# EasyEDA schematic 1-Schematic_V1.0-A4988.json
TITLE: 步进电机驱动板; REV: 1.0; Date: 2021-02-19; Sheet: 1/1; Drawn By: Poaoz; Company: Your Company
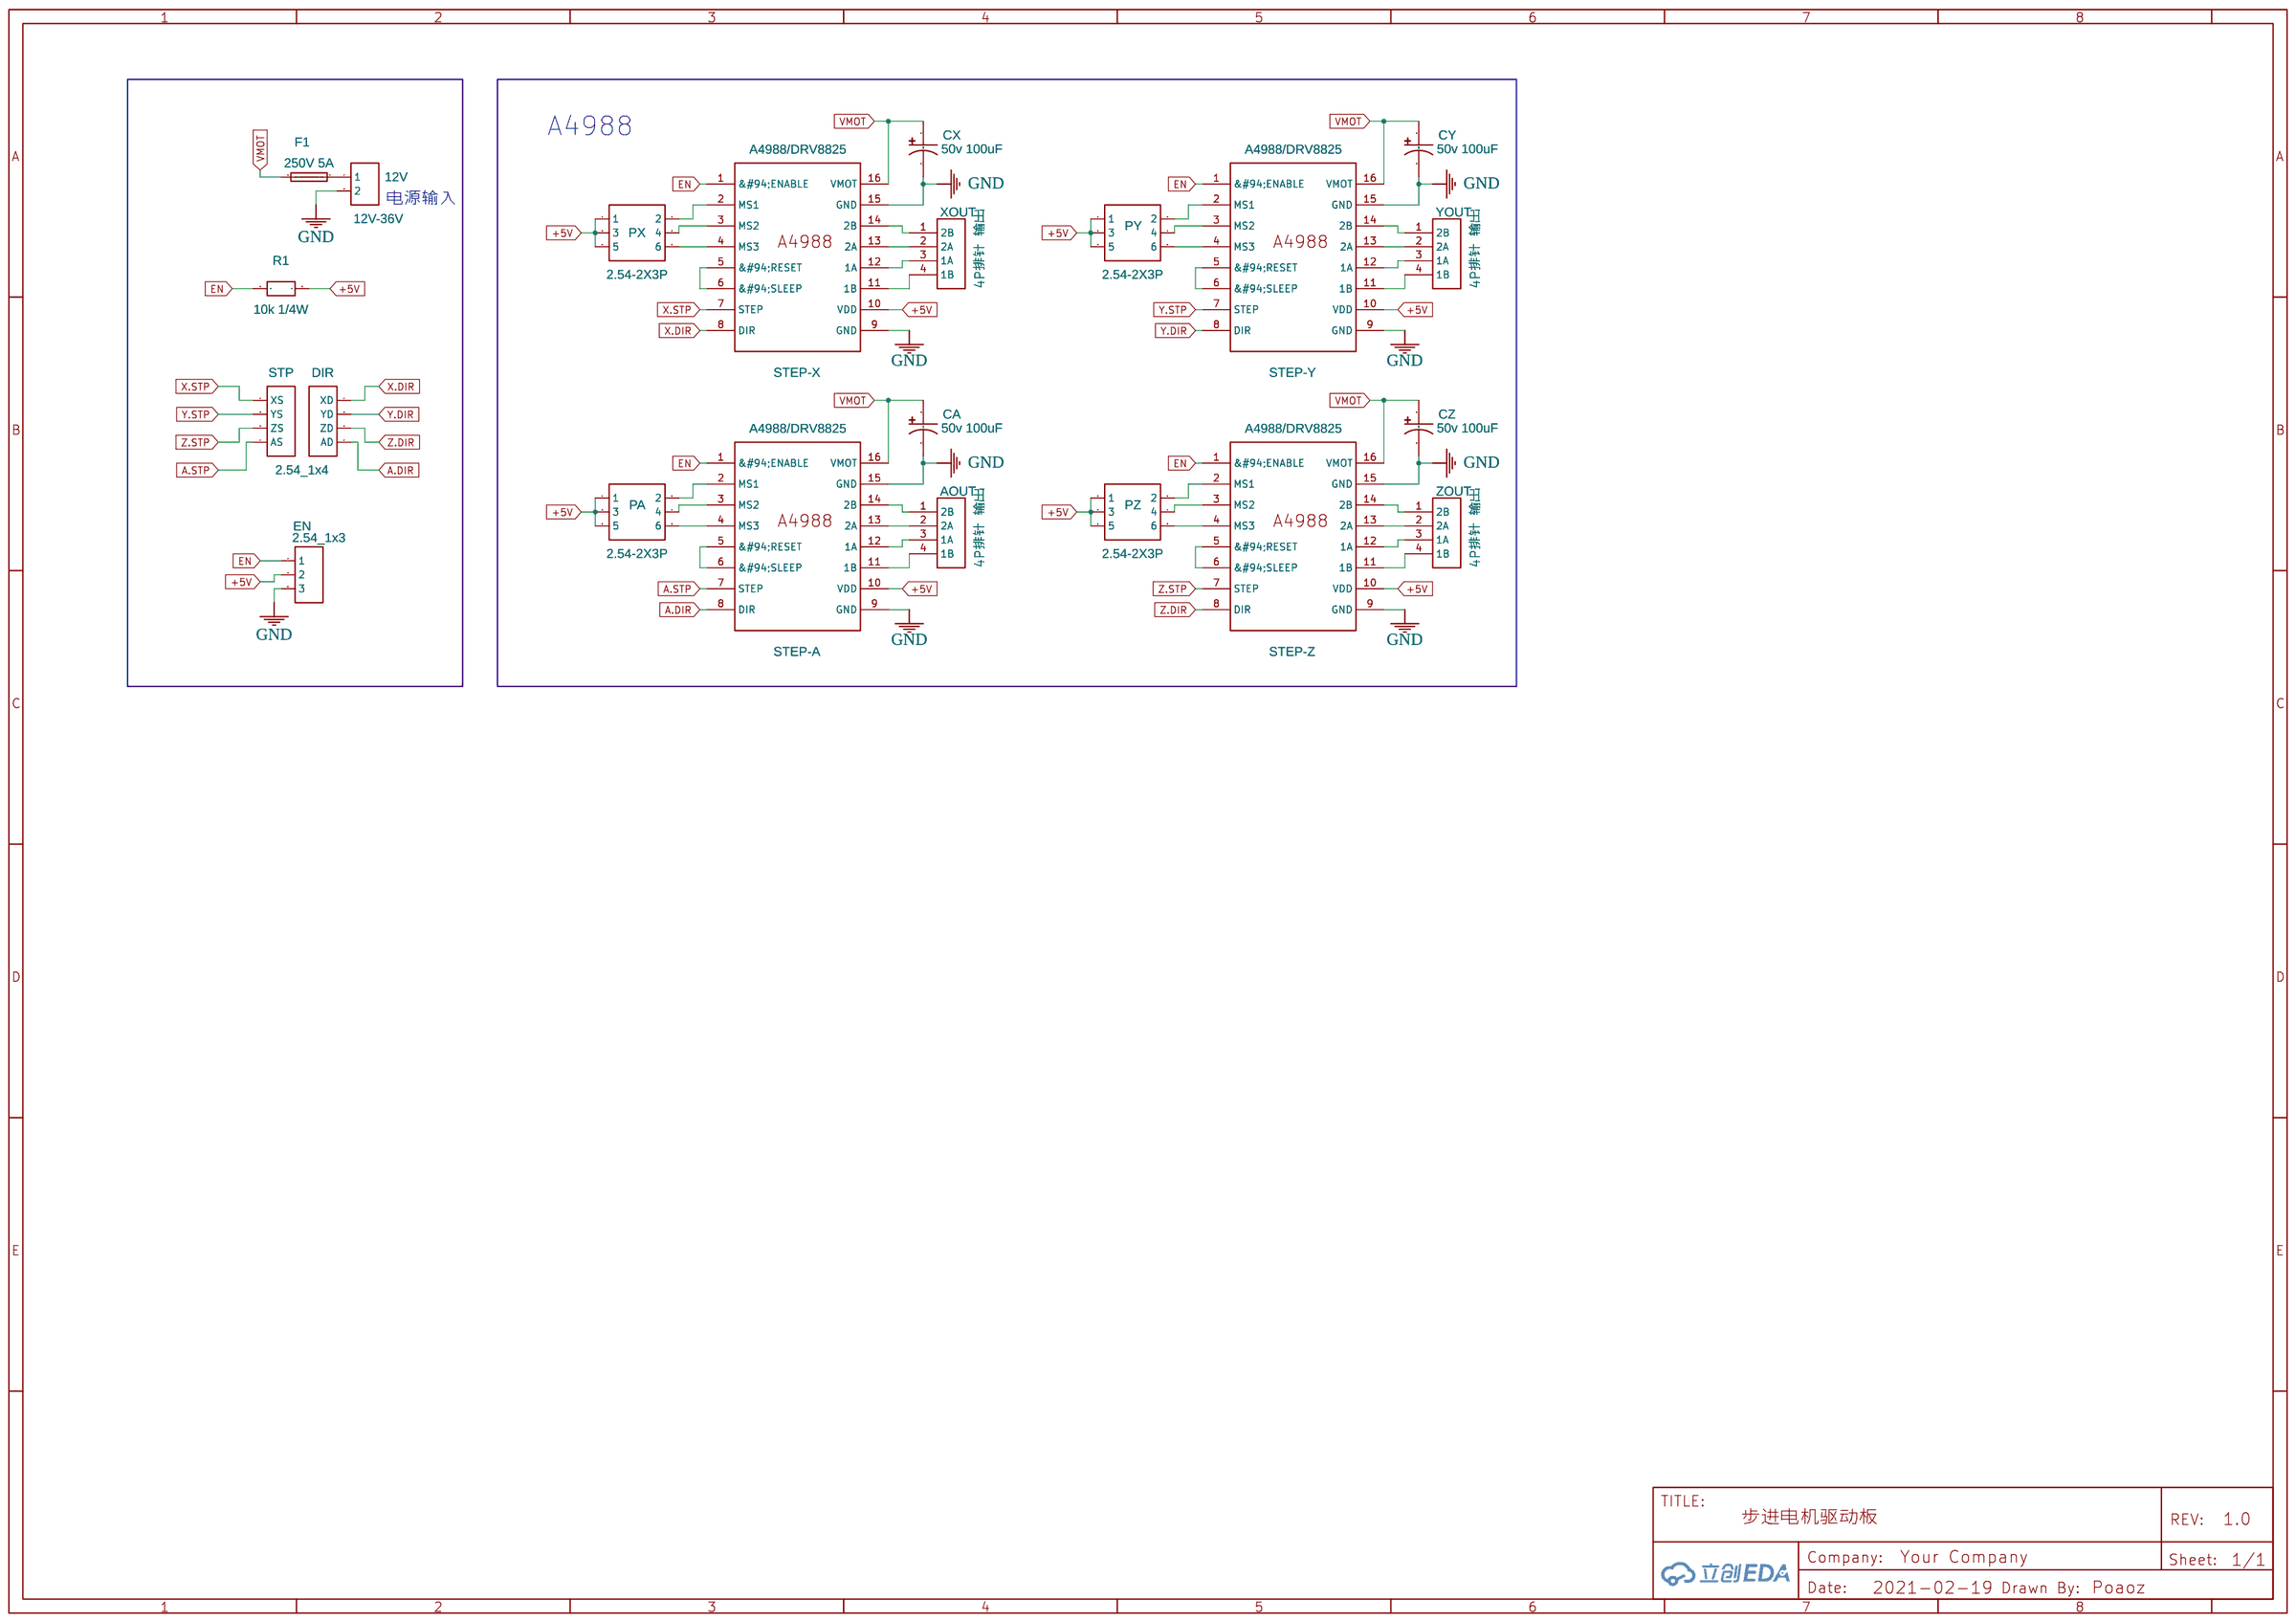
[diagram p0: schematic sheet]

## Parts
12V  12V-36V  [CONN-TH_2P-P5.00]
AOUT  4P排针 输出  [HDR-M-2.54_1X4]
CA  50v 100uF  [CAP-TH_BD8.0-P3.50-D1.0-FD]
CX  50v 100uF  [CAP-TH_BD8.0-P3.50-D1.0-FD]
CY  50v 100uF  [CAP-TH_BD8.0-P3.50-D1.0-FD]
CZ  50v 100uF  [CAP-TH_BD8.0-P3.50-D1.0-FD]
DIR  2.54_1x4  [HDR-M-2.54_1X4]
EN  2.54_1x3  [HDR-M-2.54_1X3]
F1  250V 5A  [FUSE]
PA  2.54-2X3P  [HDR-M-2.54_2X3]
PX  2.54-2X3P  [HDR-M-2.54_2X3]
PY  2.54-2X3P  [HDR-M-2.54_2X3]
PZ  2.54-2X3P  [HDR-M-2.54_2X3]
R1  10k 1/4W  [10K直插电阻 PCB封装]
STEP-A  A4988/DRV8825  [A4988 STEPPER MOTOR DRIVER CARRIER]
STEP-X  A4988/DRV8825  [A4988 STEPPER MOTOR DRIVER CARRIER]
STEP-Y  A4988/DRV8825  [A4988 STEPPER MOTOR DRIVER CARRIER]
STEP-Z  A4988/DRV8825  [A4988 STEPPER MOTOR DRIVER CARRIER]
STP  HDR-F-2.54_1x4  [HDR-M-2.54_1X4]
XOUT  4P排针 输出  [HDR-M-2.54_1X4]
YOUT  4P排针 输出  [HDR-M-2.54_1X4]
ZOUT  4P排针 输出  [HDR-M-2.54_1X4]

## Library data of the parts
12V = CONN-TH_2P-P5.00: Supplier: LCSC; Contributor: LCEDA_Lib
AOUT YOUT ZOUT = 4P排针: Contributor: Poaoz
CA CX CY CZ = NXA-50V100-8*11.5: Supplier: LCSC; Supplier Part: C165524; Manufacturer: SamYoung Electronics; Contributor: LCSC
DIR STP = HDR-F-2.54_1x4: Supplier Part: C225501; Supplier: LCSC; Contributor: LCEDA_Lib; Package Display: No
EN = HDR-F-2.54_1x3: Supplier Part: C146690; Supplier: LCSC; Contributor: LCEDA_Lib; Package Display: No
F1 = 250V 5A Slow break: Supplier: LCSC; Manufacturer: XCFuse; image: //image.lceda.cn/szlcsc/C38454.jpg; Supplier Part: C38454; Package Display: No
PA PY PZ = HDR-IDC-2.54-2X3P: Supplier: LCSC; Manufacturer: BOOMELE; Manufacturer Part: 2X3 2.54mm IDC Box; image: //image.lceda.cn/szlcsc/C11214.jpg; Supplier Part: C11214
PX = HDR-IDC-2.54-2X3P: Supplier: LCSC; Manufacturer: BOOMELE; Manufacturer Part: 2X3 2.54mm IDC Box; image: //image.lceda.cn/szlcsc/C11214.jpg; Supplier Part: C11214; Package Display: No
R1 = R_0603_EU: Contributor: LCEDA_Lib
STEP-A STEP-X = A4988/DRV8825: Contributor: Poaoz; Package Display: No
STEP-Y STEP-Z = A4988/DRV8825: Contributor: Poaoz
XOUT = 4P排针: Contributor: Poaoz; Package Display: No

## Nets
+5V: EN.2 PA.1 PA.3 PA.5 PX.1 PX.3 PX.5 PY.1 PY.3 PY.5 PZ.1 PZ.3 PZ.5 R1.2 STEP-A.10(VDD) STEP-X.10(VDD) STEP-Y.10(VDD) STEP-Z.10(VDD)
GND: 12V.2 CA.2 CX.2 CY.2 CZ.2 EN.3 STEP-A.9(GND) STEP-A.15(GND) STEP-X.9(GND) STEP-X.15(GND) STEP-Y.9(GND) STEP-Y.15(GND) STEP-Z.9(GND) STEP-Z.15(GND)
A.DIR: DIR.1(AD) STEP-A.8(DIR)
A.STP: STEP-A.7(STEP) STP.4(AS)
EN: EN.1 R1.1 STEP-A.1(&#94;ENABLE) STEP-X.1(&#94;ENABLE) STEP-Y.1(&#94;ENABLE) STEP-Z.1(&#94;ENABLE)
VMOT: CA.1 CX.1 CY.1 CZ.1 F1.2 STEP-A.16(VMOT) STEP-X.16(VMOT) STEP-Y.16(VMOT) STEP-Z.16(VMOT)
X.DIR: DIR.4(XD) STEP-X.8(DIR)
X.STP: STEP-X.7(STEP) STP.1(XS)
Y.DIR: DIR.3(YD) STEP-Y.8(DIR)
Y.STP: STEP-Y.7(STEP) STP.2(YS)
Z.DIR: DIR.2(ZD) STEP-Z.8(DIR)
Z.STP: STEP-Z.7(STEP) STP.3(ZS)
Net-(12V-1): 12V.1 F1.1
Net-(AOUT-1): AOUT.1(2B) STEP-A.14(2B)
Net-(AOUT-2): AOUT.2(2A) STEP-A.13(2A)
Net-(AOUT-3): AOUT.3(1A) STEP-A.12(1A)
Net-(AOUT-4): AOUT.4(1B) STEP-A.11(1B)
Net-(PA-2): PA.2 STEP-A.2(MS1)
Net-(PA-4): PA.4 STEP-A.3(MS2)
Net-(PA-6): PA.6 STEP-A.4(MS3)
Net-(PX-2): PX.2 STEP-X.2(MS1)
Net-(PX-4): PX.4 STEP-X.3(MS2)
Net-(PX-6): PX.6 STEP-X.4(MS3)
Net-(PY-2): PY.2 STEP-Y.2(MS1)
Net-(PY-4): PY.4 STEP-Y.3(MS2)
Net-(PY-6): PY.6 STEP-Y.4(MS3)
Net-(PZ-2): PZ.2 STEP-Z.2(MS1)
Net-(PZ-4): PZ.4 STEP-Z.3(MS2)
Net-(PZ-6): PZ.6 STEP-Z.4(MS3)
Net-(STEP-A-5): STEP-A.5(&#94;RESET) STEP-A.6(&#94;SLEEP)
Net-(STEP-X-5): STEP-X.5(&#94;RESET) STEP-X.6(&#94;SLEEP)
Net-(STEP-X-11): STEP-X.11(1B) XOUT.4(1B)
Net-(STEP-X-12): STEP-X.12(1A) XOUT.3(1A)
Net-(STEP-X-13): STEP-X.13(2A) XOUT.2(2A)
Net-(STEP-X-14): STEP-X.14(2B) XOUT.1(2B)
Net-(STEP-Y-5): STEP-Y.5(&#94;RESET) STEP-Y.6(&#94;SLEEP)
Net-(STEP-Y-11): STEP-Y.11(1B) YOUT.4(1B)
Net-(STEP-Y-12): STEP-Y.12(1A) YOUT.3(1A)
Net-(STEP-Y-13): STEP-Y.13(2A) YOUT.2(2A)
Net-(STEP-Y-14): STEP-Y.14(2B) YOUT.1(2B)
Net-(STEP-Z-5): STEP-Z.5(&#94;RESET) STEP-Z.6(&#94;SLEEP)
Net-(STEP-Z-11): STEP-Z.11(1B) ZOUT.4(1B)
Net-(STEP-Z-12): STEP-Z.12(1A) ZOUT.3(1A)
Net-(STEP-Z-13): STEP-Z.13(2A) ZOUT.2(2A)
Net-(STEP-Z-14): STEP-Z.14(2B) ZOUT.1(2B)

## Notes on the sheet
- A4988
- 电源输入
